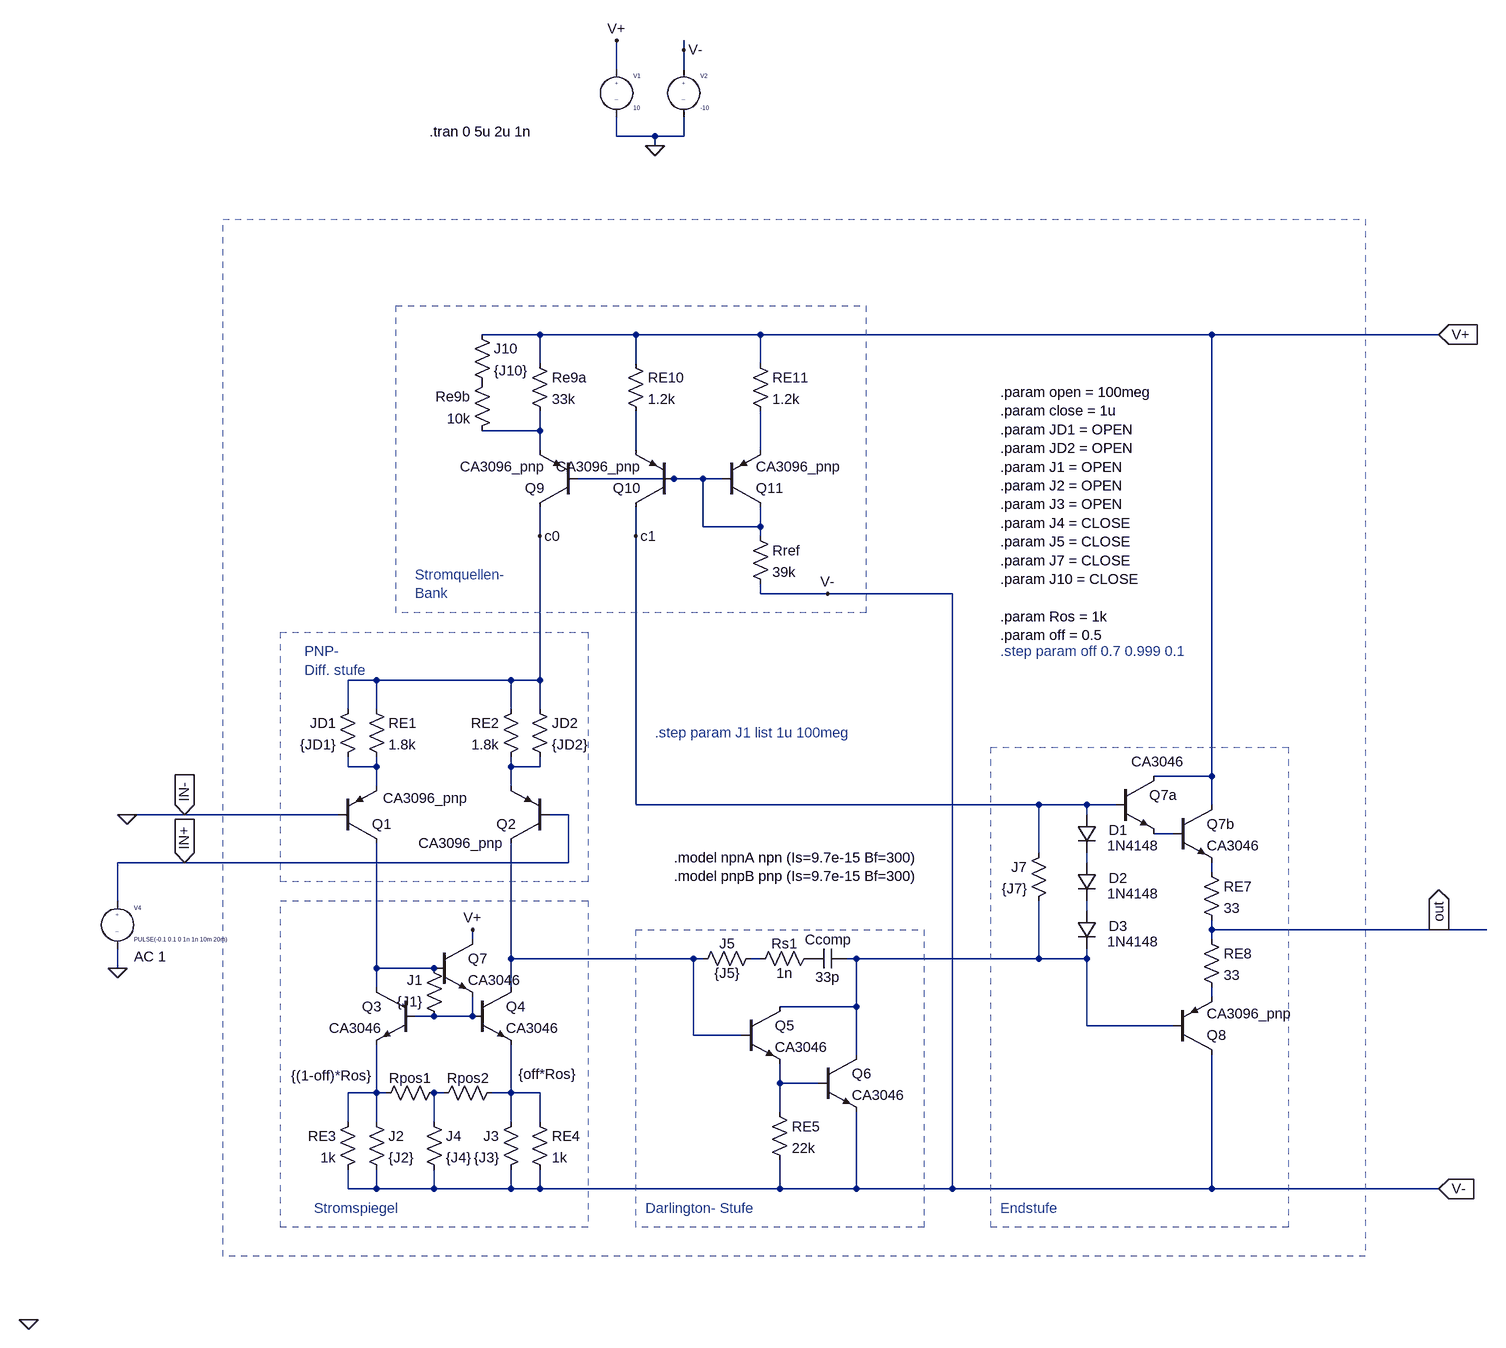
[diagram p0: schematic SlewRate.asc]
SlewRate.asc, the LTspice schematic file:
Version 4
SHEET 1 1188 2276
WIRE -528 -1120 -528 -1136
WIRE -640 -1088 -640 -1136
WIRE -528 -1088 -528 -1120
WIRE -640 -976 -640 -1008
WIRE -576 -976 -640 -976
WIRE -528 -976 -528 -1008
WIRE -528 -976 -576 -976
WIRE -576 -960 -576 -976
WIRE -768 -464 -864 -464
WIRE -608 -464 -768 -464
WIRE -400 -464 -608 -464
WIRE 352 -464 -400 -464
WIRE 736 -464 352 -464
WIRE -768 -416 -768 -464
WIRE -608 -416 -608 -464
WIRE -400 -416 -400 -464
WIRE -768 -304 -768 -336
WIRE -768 -304 -864 -304
WIRE -768 -272 -768 -304
WIRE -608 -272 -608 -336
WIRE -400 -272 -400 -336
WIRE -544 -224 -704 -224
WIRE -496 -224 -544 -224
WIRE -464 -224 -496 -224
WIRE -496 -144 -496 -224
WIRE -400 -144 -400 -176
WIRE -400 -144 -496 -144
WIRE -768 -128 -768 -176
WIRE -608 -128 -608 -176
WIRE -400 -128 -400 -144
WIRE -400 -32 -400 -48
WIRE -288 -32 -400 -32
WIRE -80 -32 -288 -32
WIRE -1040 112 -1088 112
WIRE -816 112 -1040 112
WIRE -768 112 -768 -128
WIRE -768 112 -816 112
WIRE -1088 160 -1088 112
WIRE -1040 160 -1040 112
WIRE -816 160 -816 112
WIRE -768 160 -768 112
WIRE -1088 256 -1088 240
WIRE -1040 256 -1040 240
WIRE -1040 256 -1088 256
WIRE -816 256 -816 240
WIRE -768 256 -768 240
WIRE -768 256 -816 256
WIRE 352 272 352 -464
WIRE 352 272 256 272
WIRE -1040 288 -1040 256
WIRE -816 288 -816 256
WIRE -608 320 -608 -128
WIRE 64 320 -608 320
WIRE 144 320 64 320
WIRE 192 320 144 320
WIRE 352 320 352 272
WIRE -1456 336 -1472 336
WIRE -1360 336 -1456 336
WIRE -1104 336 -1360 336
WIRE -720 336 -752 336
WIRE 144 336 144 320
WIRE 288 368 256 368
WIRE 64 400 64 320
WIRE -1360 416 -1472 416
WIRE -720 416 -720 336
WIRE -720 416 -1360 416
WIRE 144 416 144 400
WIRE 352 432 352 416
WIRE -1472 480 -1472 416
WIRE 144 496 144 480
WIRE 352 528 352 512
WIRE 736 528 352 528
WIRE 816 528 736 528
WIRE -880 544 -880 528
WIRE 352 544 352 528
WIRE -816 576 -816 384
WIRE -512 576 -816 576
WIRE -496 576 -512 576
WIRE -400 576 -416 576
WIRE -240 576 -256 576
WIRE 64 576 64 480
WIRE 64 576 -240 576
WIRE 144 576 144 560
WIRE 144 576 64 576
WIRE -1472 592 -1472 560
WIRE -1040 592 -1040 384
WIRE -944 592 -1040 592
WIRE -1040 624 -1040 592
WIRE -816 624 -816 576
WIRE 352 640 352 624
WIRE -240 656 -240 576
WIRE -240 656 -368 656
WIRE -944 672 -976 672
WIRE -880 672 -880 640
WIRE -880 672 -944 672
WIRE 144 688 144 576
WIRE 288 688 144 688
WIRE -512 704 -512 576
WIRE -432 704 -512 704
WIRE -240 736 -240 656
WIRE -368 784 -368 752
WIRE -304 784 -368 784
WIRE -1040 800 -1040 720
WIRE -1040 800 -1088 800
WIRE -1024 800 -1040 800
WIRE -928 800 -944 800
WIRE -816 800 -816 720
WIRE -816 800 -848 800
WIRE -768 800 -816 800
WIRE -368 832 -368 784
WIRE -1088 848 -1088 800
WIRE -1040 848 -1040 800
WIRE -944 848 -944 800
WIRE -816 848 -816 800
WIRE -768 848 -768 800
WIRE -1088 960 -1088 928
WIRE -1040 960 -1040 928
WIRE -1040 960 -1088 960
WIRE -944 960 -944 928
WIRE -944 960 -1040 960
WIRE -816 960 -816 928
WIRE -816 960 -944 960
WIRE -768 960 -768 928
WIRE -768 960 -816 960
WIRE -368 960 -368 912
WIRE -368 960 -768 960
WIRE -240 960 -240 832
WIRE -240 960 -368 960
WIRE -80 960 -80 -32
WIRE -80 960 -240 960
WIRE 352 960 352 736
WIRE 352 960 -80 960
WIRE 736 960 352 960
FLAG 736 -464 V+
IOPIN 736 -464 In
FLAG -288 -32 V-
FLAG -768 -128 c0
FLAG -608 -128 c1
FLAG -1360 416 IN+
IOPIN -1360 416 In
FLAG -1360 336 IN-
IOPIN -1360 336 In
FLAG 736 960 V-
IOPIN 736 960 In
FLAG 736 528 out
IOPIN 736 528 Out
FLAG -576 -960 0
FLAG -640 -1136 V+
FLAG -528 -1120 V-
FLAG -880 528 V+
FLAG -1920 2256 0
FLAG -1472 592 0
FLAG -1456 336 0
SYMBOL EIT_Semiconductors\\pnp -704 -176 R180
SYMATTR InstName Q9
SYMATTR Value CA3096_pnp
SYMBOL EIT_Semiconductors\\pnp -544 -176 R180
SYMATTR InstName Q10
SYMATTR Value CA3096_pnp
SYMBOL EIT_Semiconductors\\pnp -464 -176 M180
SYMATTR InstName Q11
SYMATTR Value CA3096_pnp
SYMBOL res -416 -432 R0
SYMATTR InstName RE11
SYMATTR Value 1.2k
SYMBOL res -624 -432 R0
SYMATTR InstName RE10
SYMATTR Value 1.2k
SYMBOL res -784 -432 R0
SYMATTR InstName Re9a
SYMATTR Value 33k
SYMBOL res -848 -400 M0
SYMATTR InstName Re9b
SYMATTR Value 10k
SYMBOL res -416 -144 R0
SYMATTR InstName Rref
SYMATTR Value 39k
SYMBOL EIT_Semiconductors\\pnp -752 384 R180
WINDOW 3 77 0 Left 2
SYMATTR Value CA3096_pnp
SYMATTR InstName Q2
SYMBOL EIT_Semiconductors\\pnp -1104 384 M180
WINDOW 3 75 75 Left 2
SYMATTR Value CA3096_pnp
SYMATTR InstName Q1
SYMBOL res -1056 144 R0
SYMATTR InstName RE1
SYMATTR Value 1.8k
SYMBOL res -800 144 M0
SYMATTR InstName RE2
SYMATTR Value 1.8k
SYMBOL res -1072 144 M0
SYMATTR InstName JD1
SYMATTR Value {JD1}
SYMBOL res -784 144 R0
SYMATTR InstName JD2
SYMATTR Value {JD2}
SYMBOL EIT_Semiconductors\\npn -976 624 M0
SYMATTR InstName Q3
SYMATTR Value CA3046
SYMBOL EIT_Semiconductors\\npn -880 624 R0
SYMATTR InstName Q4
SYMATTR Value CA3046
SYMBOL res -928 784 R90
WINDOW 0 7 56 VBottom 2
WINDOW 3 -28 188 VTop 2
SYMATTR InstName Rpos1
SYMATTR Value {(1-off)*Ros}
SYMBOL res -1056 832 R0
SYMATTR InstName J2
SYMATTR Value {J2}
SYMBOL res -800 832 M0
SYMATTR InstName J3
SYMATTR Value {J3}
SYMBOL res -1072 832 M0
SYMATTR InstName RE3
SYMATTR Value 1k
SYMBOL res -784 832 R0
SYMATTR InstName RE4
SYMATTR Value 1k
SYMBOL res -928 688 R180
WINDOW 0 36 76 Left 2
WINDOW 3 36 40 Left 2
SYMATTR InstName J1
SYMATTR Value {J1}
SYMBOL res -832 784 R90
WINDOW 0 7 56 VBottom 2
WINDOW 3 -31 -76 VTop 2
SYMATTR InstName Rpos2
SYMATTR Value {off*Ros}
SYMBOL res -960 832 R0
SYMATTR InstName J4
SYMATTR Value {J4}
SYMBOL res -512 592 R270
WINDOW 0 25 56 VTop 2
WINDOW 3 7 56 VBottom 2
SYMATTR InstName J5
SYMATTR Value {J5}
SYMBOL cap -256 560 R90
WINDOW 0 0 32 VBottom 2
WINDOW 3 32 32 VTop 2
SYMATTR InstName Ccomp
SYMATTR Value 33p
SYMBOL EIT_Semiconductors\\npn -304 736 R0
SYMATTR InstName Q6
SYMATTR Value CA3046
SYMBOL EIT_Semiconductors\\npn -432 656 R0
SYMATTR InstName Q5
SYMATTR Value CA3046
SYMBOL res -384 816 R0
SYMATTR InstName RE5
SYMATTR Value 22k
SYMBOL EIT_Semiconductors\\npn 288 320 R0
SYMATTR InstName Q7b
SYMATTR Value CA3046
SYMBOL EIT_Semiconductors\\npn 192 272 R0
WINDOW 3 26 -24 Left 2
SYMATTR Value CA3046
SYMATTR InstName Q7a
SYMBOL EIT_Semiconductors\\pnp 288 736 M180
SYMATTR InstName Q8
SYMATTR Value CA3096_pnp
SYMBOL res 336 416 R0
SYMATTR InstName RE7
SYMATTR Value 33
SYMBOL res 336 528 R0
SYMATTR InstName RE8
SYMATTR Value 33
SYMBOL diode 128 336 R0
WINDOW 0 53 26 Left 2
WINDOW 3 50 52 Left 2
SYMATTR InstName D1
SYMATTR Value 1N4148
SYMBOL res 80 384 M0
SYMATTR InstName J7
SYMATTR Value {J7}
SYMBOL source-V -640 -1104 R0
WINDOW 123 0 0 Left 2
WINDOW 39 0 0 Left 2
SYMATTR InstName V1
SYMATTR Value 10
SYMBOL source-V -528 -1104 R0
WINDOW 123 0 0 Left 2
WINDOW 39 0 0 Left 2
SYMATTR InstName V2
SYMATTR Value -10
SYMBOL res -304 560 R90
WINDOW 0 7 56 VBottom 2
WINDOW 3 25 56 VTop 2
SYMATTR InstName Rs1
SYMATTR Value 1n
SYMBOL source-V -1472 464 R0
WINDOW 123 28 109 Left 2
WINDOW 39 0 0 Left 2
SYMATTR Value2 AC 1
SYMATTR InstName V4
SYMATTR Value PULSE(-0.1 0.1 0 1n 1n 10m 20m)
SYMBOL diode 128 416 R0
WINDOW 0 53 26 Left 2
WINDOW 3 50 52 Left 2
SYMATTR InstName D2
SYMATTR Value 1N4148
SYMBOL diode 128 496 R0
WINDOW 0 53 26 Left 2
WINDOW 3 50 52 Left 2
SYMATTR InstName D3
SYMATTR Value 1N4148
SYMBOL res -880 -480 R0
SYMATTR InstName J10
SYMATTR Value {J10}
SYMBOL EIT_Semiconductors\\npn -944 544 R0
SYMATTR InstName Q7
SYMATTR Value CA3046
TEXT -976 -64 Left 2 ;Stromquellen-\nBank
TEXT -1160 64 Left 2 ;PNP-\nDiff. stufe
TEXT -1144 992 Left 2 ;Stromspiegel
TEXT -592 992 Left 2 ;Darlington- Stufe
TEXT 0 992 Left 2 ;Endstufe
TEXT 0 -368 Left 2 !.param open = 100meg\n.param close = 1u\n.param JD1 = OPEN\n.param JD2 = OPEN\n.param J1 = OPEN\n.param J2 = OPEN\n.param J3 = OPEN\n.param J4 = CLOSE\n.param J5 = CLOSE\n.param J7 = CLOSE\n.param J10 = CLOSE\n \n.param Ros = 1k\n.param off = 0.5
TEXT -952 -984 Left 2 !.tran 0 5u 2u 1n
TEXT 0 64 Left 2 ;.step param off 0.7 0.999 0.1
TEXT -544 408 Left 2 !.model npnA npn (Is=9.7e-15 Bf=300)\n.model pnpB pnp (Is=9.7e-15 Bf=300)
TEXT -576 200 Left 2 ;.step param J1 list 1u 100meg
RECTANGLE Normal -224 0 -1008 -512 2
RECTANGLE Normal -688 448 -1200 32 2
RECTANGLE Normal -688 1024 -1200 480 2
RECTANGLE Normal -128 1024 -608 528 2
RECTANGLE Normal 480 1024 -16 224 2
RECTANGLE Normal 608 1072 -1296 -656 1

The netlist it stands for:
* SlewRate.asc
Q9 c0 N004 N001 0 CA3096_pnp
Q10 c1 N004 N002 0 CA3096_pnp
Q11 N004 N004 N003 0 CA3096_pnp
RE11 V+ N003 1.2k
RE10 V+ N002 1.2k
Re9a V+ N001 33k
Re9b P001 N001 10k
Rref N004 V- 39k
Q2 N011 IN+ N006 0 CA3096_pnp
Q1 N014 0 N005 0 CA3096_pnp
RE1 c0 N005 1.8k
RE2 c0 N006 1.8k
R§JD1 c0 N005 {JD1}
R§JD2 c0 N006 {JD2}
Q3 N014 N016 N018 0 CA3046
Q4 N011 N016 N020 0 CA3046
Rpos1 N019 N018 {(1-off)*Ros}
R§J2 N018 V- {J2}
R§J3 N020 V- {J3}
RE3 N018 V- 1k
RE4 N020 V- 1k
R§J1 N016 N014 {J1}
Rpos2 N020 N019 {off*Ros}
R§J4 N019 V- {J4}
R§J5 N011 N012 {J5}
Ccomp N013 P002 33p
Q6 N013 N017 V- 0 CA3046
Q5 N013 N011 N017 0 CA3046
RE5 N017 V- 22k
Q7b V+ N007 N009 0 CA3046
Q7a V+ c1 N007 0 CA3046
Q8 V- N013 N015 0 CA3096_pnp
RE7 N009 out 33
RE8 out N015 33
D1 c1 N008 1N4148
R§J7 c1 N013 {J7}
V1 V+ 0 10
V2 V- 0 -10
Rs1 P002 N012 1n
V4 IN+ 0 PULSE(-0.1 0.1 0 1n 1n 10m 20m) AC 1
D2 N008 N010 1N4148
D3 N010 N013 1N4148
R§J10 V+ P001 {J10}
Q7 V+ N014 N016 0 CA3046
.model D D
.lib standard.dio
.model NPN NPN
.model PNP PNP
.lib standard.bjt
* Stromquellen-
* Bank
* PNP-
* Diff. stufe
* Stromspiegel
* Darlington- Stufe
* Endstufe
.param open = 100meg
.param close = 1u
.param JD1 = OPEN
.param JD2 = OPEN
.param J1 = OPEN
.param J2 = OPEN
.param J3 = OPEN
.param J4 = CLOSE
.param J5 = CLOSE
.param J7 = CLOSE
.param J10 = CLOSE
.param Ros = 1k
.param off = 0.5
.tran 0 5u 2u 1n
* .step param off 0.7 0.999 0.1
.model npnA npn (Is=9.7e-15 Bf=300)
.model pnpB pnp (Is=9.7e-15 Bf=300)
* .step param J1 list 1u 100meg
.backanno
.end